# EAGLE design SparkFun RTK Facet - Display SD SIM (EAGLE 9.6.2)
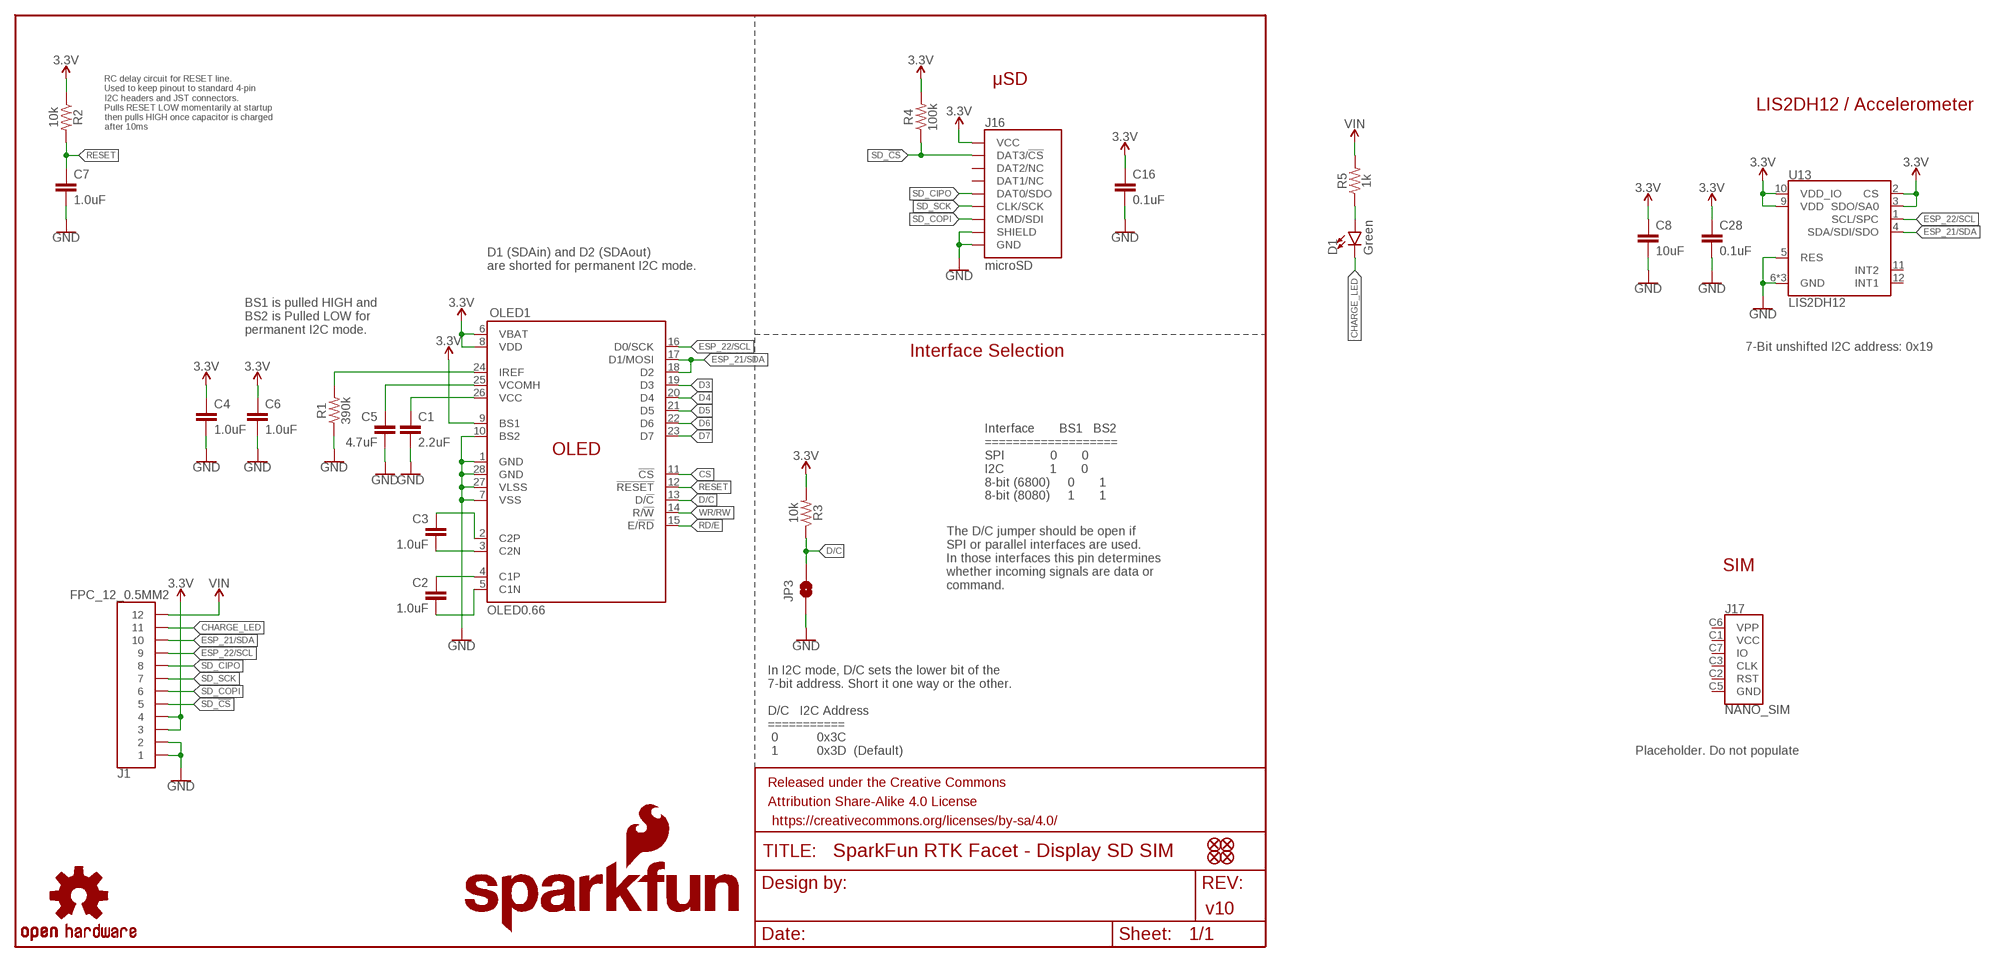
[diagram p0: schematic, sheet 1]

## Parts
C1  2.2uF  2.2UF-0805-25V-(+80/-20%)  [0805]
C2  1.0uF  1.0UF-0805-25V-10%  [0805]
C3  1.0uF  1.0UF-0805-25V-10%  [0805]
C4  1.0uF  1.0UF-0603-16V-10%  [0603]
C5  4.7uF  4.7UF-1206-16V-(+80/-20%)  [1206]
C6  1.0uF  1.0UF-0603-16V-10%  [0603]
C7  1.0uF  1.0UF-0603-16V-10%  [0603]
C8  10uF  10UF-0603-6.3V-20%  [0603]
C16  0.1uF  0.1UF-0603-25V-(+80/-20%)  [0603]
C28  0.1uF  0.1UF-0603-25V-(+80/-20%)  [0603]
D1  Green  LED-GREEN1206-BOTTOM  [LED-1206-BOTTOM]
FID1  FIDUCIAL1X2  [FIDUCIAL-1X2]
FID2  FIDUCIAL1X2  [FIDUCIAL-1X2]
FID3  FIDUCIAL1X2  [FIDUCIAL-1X2]
FID4  FIDUCIAL1X2  [FIDUCIAL-1X2]
FRAME1  FRAME-LETTER  [CREATIVE_COMMONS]
J1  FPC_12_0.5MM2  [FPC_12_FLIP_DOUBLESIDED_2]
J16  microSD  MICRO-SD-SDIOPUSH-PUSH  [MICRO-SD-SOCKET]
J17  NANO_SIM  NANO_SIMWURTH  [NANO_SIM_WURTH_693043020611]
JP3  JUMPER-SMT_2_NO_SILK  [SMT-JUMPER_2_NO_SILK]
LOGO3  OSHW-LOGOS  [OSHW-LOGO-S]
LOGO5  SFE_LOGO_NAME_FLAME.1_INCH  [SFE_LOGO_NAME_FLAME_.1]
OLED1  OLED0.66  [OLED-0.66-64X48]
R1  390k  390KOHM-0603-1/10W-1%  [0603]
R2  10k  10KOHM-0603-1/10W-1%  [0603]
R3  10k  10KOHM-0603-1/10W-1%  [0603]
R4  100k  100KOHM-0603-1/10W-1%  [0603]
R5  1k  1KOHM-0603-1/10W-1%  [0603]
U13  LIS2DH12  [LGA-12-LISDH12]

## Nets
3.3V [power]: C4.1 C6.1 C8.1 C16.1 C28.1 J1.3 J1.4 J16.VCC OLED1.6(VBAT) OLED1.8(VDD) OLED1.9(BS1) R2.1 R3.2 R4.2 U13.2(CS) U13.3(SDO/SA0) U13.9(VDD) U13.10(VDD_IO)
C1P: C2.1 OLED1.4(C1P)
C2N: C3.2 OLED1.3(C2N)
CHARGE_LED: D1.C J1.11
CS: OLED1.11(!CS!)
D3: OLED1.19(D3)
D4: OLED1.20(D4)
D5: OLED1.21(D5)
D6: OLED1.22(D6)
D7: OLED1.23(D7)
D/C: JP3.2 OLED1.13(D/!C!) R3.1
ESP_21/SDA: J1.10 OLED1.17(D1/MOSI) OLED1.18(D2) U13.4(SDA/SDI/SDO)
ESP_22/SCL: J1.9 OLED1.16(D0/SCK) U13.1(SCL/SPC)
GND: C1.2 C4.2 C5.2 C6.2 C7.2 C8.2 C16.2 C28.2 J1.1 J1.2 J16.CD1(SHIELD) J16.GND J16.GND1(GND) J16.GND3(GND) JP3.1 OLED1.1(GND) OLED1.7(VSS) OLED1.10(BS2) OLED1.27(VLSS) OLED1.28(GND) R1.1 U13.5(RES) U13.6(GND) U13.7(GND) U13.8(GND)
IREF: OLED1.24(IREF) R1.2
N$1: C3.1 OLED1.2(C2P)
N$2: C2.2 OLED1.5(C1N)
N$3: D1.A R5.1
RD/E: OLED1.15(E/!RD!)
RESET: C7.1 OLED1.12(!RESET!) R2.2
SD_!CS!: J1.5 J16.CS/DAT3(DAT3/!CS!) R4.1
SD_CIPO: J1.8 J16.DO/DAT0(DAT0/SDO)
SD_COPI: J1.6 J16.DI/CMD(CMD/SDI)
SD_SCK: J1.7 J16.SCLK(CLK/SCK)
VCC: C1.1 OLED1.26(VCC)
VCOMH: C5.1 OLED1.25(VCOMH)
VIN: J1.12 R5.2
WR/RW: OLED1.14(R/!W!)
Unconnected: J16.DAT1(DAT1/NC) J16.DAT2(DAT2/NC) J17.C1(VCC) J17.C2(RST) J17.C3(CLK) J17.C5(GND) J17.C6(VPP) J17.C7(IO) U13.11(INT2) U13.12(INT1)

## Notes on the sheet
- μSD
- LIS2DH12 / Accelerometer
- RC delay circuit for RESET line. 
  Used to keep pinout to standard 4-pin
  I2C headers and JST connectors. 
  Pulls RESET LOW momentarily at startup
  then pulls HIGH once capacitor is charged
  after 10ms
- D1 (SDAin) and D2 (SDAout)
  are shorted for permanent I2C mode.
- BS1 is pulled HIGH and 
  BS2 is Pulled LOW for 
  permanent I2C mode.
- 7-Bit unshifted I2C address: 0x19
- Interface Selection
- Interface       BS1   BS2
  ===================
  SPI             0       0
  I2C             1       0
  8-bit (6800)     0       1
  8-bit (8080)     1       1
- SIM
- The D/C jumper should be open if
  SPI or parallel interfaces are used.
  In those interfaces this pin determines
  whether incoming signals are data or
  command.
- In I2C mode, D/C sets the lower bit of the 
  7-bit address. Short it one way or the other.
  
  D/C   I2C Address
  ===========
   0           0x3C
   1           0x3D  (Default)
- Placeholder. Do not populate
- v10

## Library data of the parts
C1 = SparkFun-Capacitors:2.2UF: 2.2µF ceramic capacitors A capacitor is a passive two-terminal electrical component used to store electrical energy temporarily in an electric field.; PROD_ID: CAP-11624
C2 C3 = SparkFun-Capacitors:1.0UF: 1µF ceramic capacitors A capacitor is a passive two-terminal electrical component used to store electrical energy temporarily in an electric field.; PROD_ID: CAP-08064
C4 C6 C7 = SparkFun-Capacitors:1.0UF: 1µF ceramic capacitors A capacitor is a passive two-terminal electrical component used to store electrical energy temporarily in an electric field.; PROD_ID: CAP-00868
C5 = SparkFun-Capacitors:4.7UF: 4.7µF ceramic capacitors A capacitor is a passive two-terminal electrical component used to store electrical energy temporarily in an electric field.; PROD_ID: CAP-10300
C8 = SparkFun-Capacitors:10UF: 10.0µF ceramic capacitors A capacitor is a passive two-terminal electrical component used to store electrical energy temporarily in an electric field.; PROD_ID: CAP-11015
C16 C28 = SparkFun-Capacitors:0.1UF: 0.1µF ceramic capacitors A capacitor is a passive two-terminal electrical component used to store electrical energy temporarily in an electric field.; PROD_ID: CAP-00810
D1 = SparkFun-LED:LED-GREEN: Green SMD LED Used in manufacturing of various products at SparkFun Packages: 0603 - SMD 0603 package [Product Link] <http://www.futureelectronics.com/en/technologies/semiconductors/optoelectronics/leds/Pages/9894312-LTST-C190GKT.aspx?CrossPart=HSMG-C190&IM=0> LilyPad 1206 - SMD1206 LilyPad package [Product Link] <http://www.futureelectronics.com/en/Technologies/Product.aspx?ProductID=IN150NGHARVATEKCORPORATION2049943&IM=0> 1206 - SMD1206 package [Product Link] <http://www.futureelectronics.com/en/technologies/semiconductors/optoelectronics/leds/Pages/8315665-LTST-C150KGKT.aspx?IM=0> 1206 Bottom Mount -SMD 1206 Bottom Mount [Product Link] <http://www.digikey.com/product-detail/en/lite-on-inc/LTST-C230KGKT/160-1456-1-ND/386854> SparkFun Products: Pro Mini 328 -5V <https://www.sparkfun.com/products/821> RedBoard <https://www.sparkfun.com/products/12757> MP3 Trigger <https://www.sparkfun.com/products/13720> Makey Makey <https://www.sparkfun.com/products/11076>; PROD_ID: DIO-11076
FID1-FID4 = SparkFun-Aesthetics:FIDUCIAL: Fiducial Alignment Points Point-of-reference for pick-and-place machines and other optical instruments.
FRAME1 = SparkFun-Aesthetics:FRAME-LETTER: Schematic Frame - Letter Standard 8.5x11 US Letter frame
J1 = RTK Facet:FPC_12_0.5MM
J16 = SparkFun-Connectors:MICRO-SD-SDIO: microSD Socket for Transflash Push-push type µSD socket. tDoc lines correctly indicate media card edge positions when inserting (unlocked, locked, depressed). NOTE: CD1 and CD2 are connected internally, and the default detect state of the socket is detect pin to ground. SparkFun Products: WAV Trigger <https://www.sparkfun.com/products/13660> CAN-Bus Shield <https://www.sparkfun.com/products/13262> SparkFun Level Shifing microSD Breakout <https://www.sparkfun.com/products/13743>; PROD_ID: CONN-07820
J17 = ublox:NANO_SIM; PROD_ID: CONN-14097
JP3 = SparkFun-Jumpers:JUMPER-SMT_2_NO: Normally open jumper This jumper has two pads in close proximity to each other. Apply solder to close the connection. Round pads are easier to solder for beginners, but are a lot larger. SparkFun Product that uses the round pads: SparkFun EL Sequencer <https://www.sparkfun.com/products/12781>
LOGO3 = SparkFun-Aesthetics:OSHW-LOGO: Open-Source Hardware (OSHW) Logo This logo indicates the piece of hardware it is found on incorporates a OSHW license and/or adheres to the definition of open source hardware found here: http://freedomdefined.org/OSHW
LOGO5 = SparkFun-Aesthetics:SFE_LOGO_NAME_FLAME: SparkFun Font Logo w/ Flame This is the SparkFun full logo. The logo on the schematic will always be the same size; the package variant is the height of the flame part of the logo. Default layer for the logo on the board is tSilk.
OLED1 = SparkFun-Displays:OLED0.66: Micro OLED TODO: Add description SparkFun Products: Micro OLED Breakout <https://www.sparkfun.com/products/13003>; PROD_ID: LCD-12019
R1 = SparkFun-Resistors:390KOHM: 390kΩ resistor A resistor is a passive two-terminal electrical component that implements electrical resistance as a circuit element. Resistors act to reduce current flow, and, at the same time, act to lower voltage levels within circuits. - Wikipedia; PROD_ID: RES-12024
R2 R3 = SparkFun-Resistors:10KOHM: 10kΩ resistor A resistor is a passive two-terminal electrical component that implements electrical resistance as a circuit element. Resistors act to reduce current flow, and, at the same time, act to lower voltage levels within circuits. - Wikipedia; PROD_ID: RES-00824
R4 = SparkFun-Resistors:100KOHM: 100kΩ resistor A resistor is a passive two-terminal electrical component that implements electrical resistance as a circuit element. Resistors act to reduce current flow, and, at the same time, act to lower voltage levels within circuits. - Wikipedia; PROD_ID: RES-07828
R5 = SparkFun-Resistors:1KOHM: 1kΩ resistor A resistor is a passive two-terminal electrical component that implements electrical resistance as a circuit element. Resistors act to reduce current flow, and, at the same time, act to lower voltage levels within circuits. - Wikipedia; PROD_ID: RES-07856
U13 = SparkFun-Sensors:LIS2DH12; DIGIKEY: 497-14851-2-ND; PROD_ID: IC-14229

## Net classes
0 default: width 0 mm, drill 0 mm
1 power: width 0.178 mm

## Board
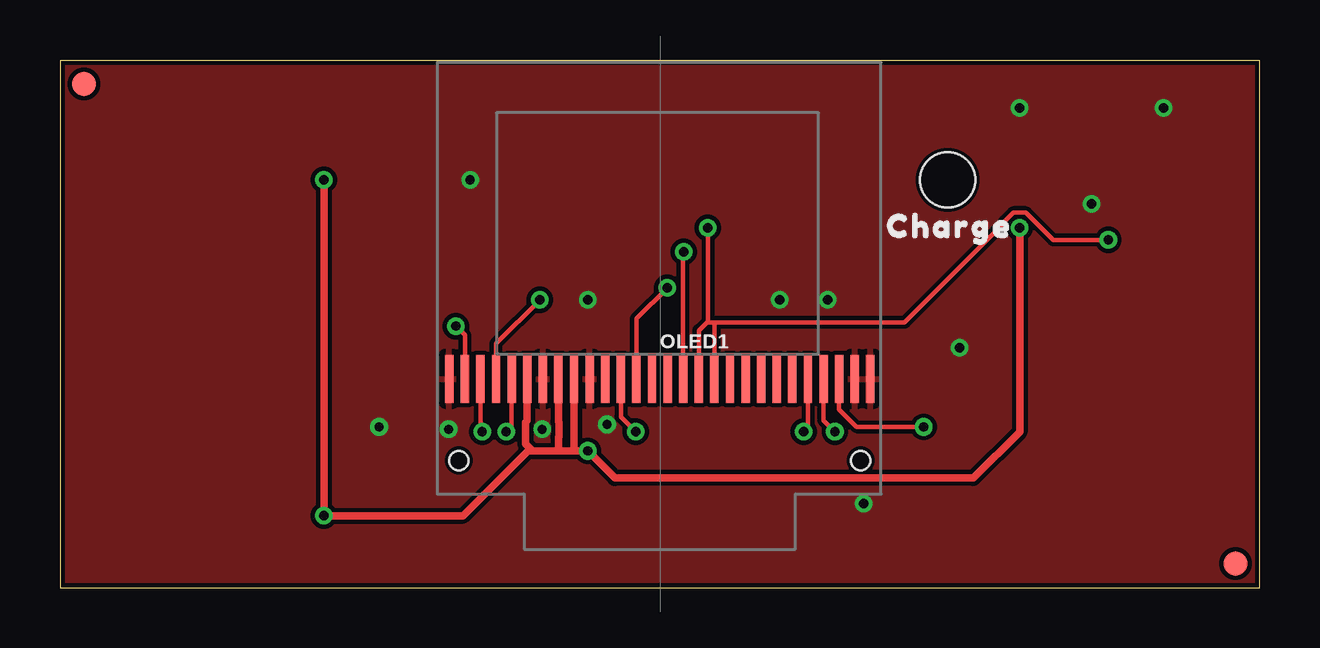
[diagram p1: board, top side]
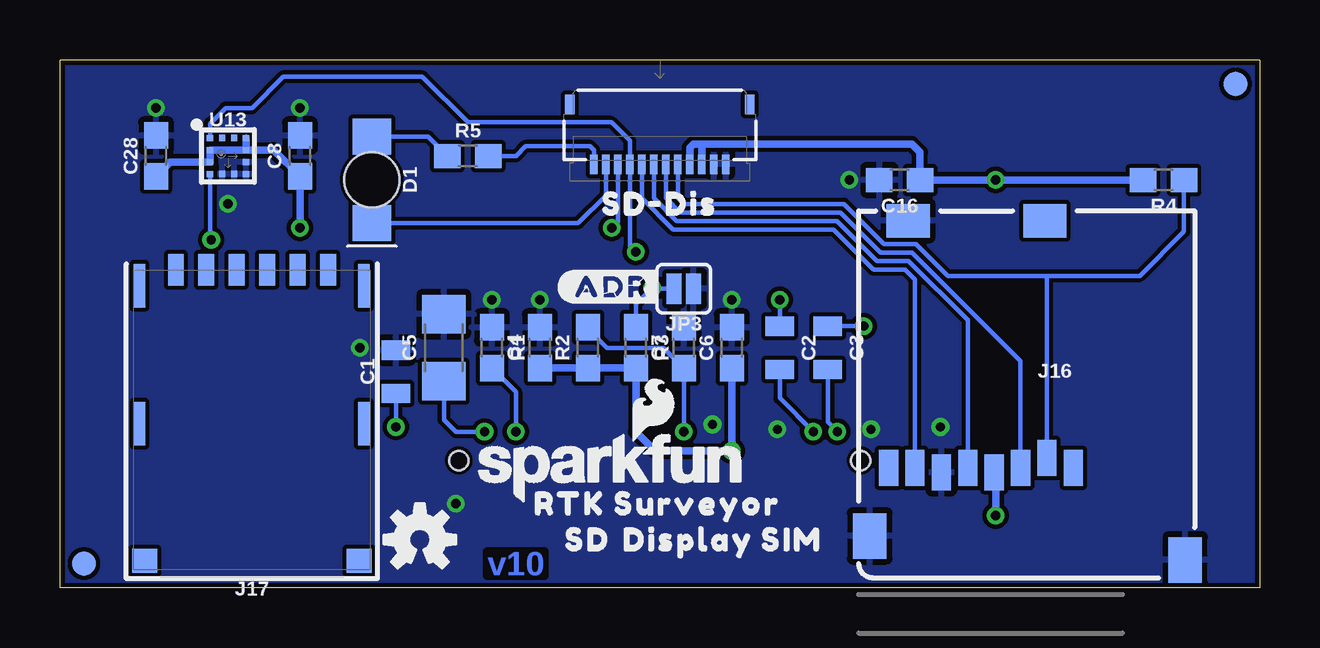
[diagram p2: board, bottom side, seen from below]

Size 50 x 22 mm. Coordinates in mm from the lower left corner, seen from the top.
Outline: 50,0 50,22 0,22 0,0 50,0
Copper layers (1*16): Top 0.035mm / dielectric 1.5mm / Bottom 0.035mm
Design rules "SparkFun-2-layer-TIGHT": minimum track width 7mil, minimum drill 15mil, track to track 7mil, track to pad 7mil, pad to pad 7mil, via to via 7mil, smd to smd 7mil, copper to edge 7mil, drill to drill 7mil, minimum pad ring 7mil, minimum via ring 7mil, stop-mask expansion 4mil, vias tented up to drill 25mil, thermal gap 10mil
tKeepout: area 0,0 to 2,22; area 48,0 to 50,22
bKeepout: area 0,0 to 2,22; area 48,0 to 50,22

### Footprints (pad centres in the part's own frame; a part is rotated, then mirrored left to right if it is on the bottom)
0805 = smd 0.8 x 1.2: 1 -0.9,0; 2 0.9,0
0603 = smd 1.1 x 1: 1 -0.85,0; 2 0.85,0
1206 = smd 1.6 x 1.8: 1 -1.4,0; 2 1.4,0
LED-1206-BOTTOM = smd 1.5 x 1.6: A -1.8,0; C 1.8,0 | hole 2.3: 0,0
FIDUCIAL-1X2 = smd 1 x 1: 1 0,0
FPC_12_FLIP_DOUBLESIDED_2 = smd 0.3 x 0.8: 1 -2.75,1.35; 2 -2.25,1.35; 3 -1.75,1.35; 4 -1.25,1.35; 5 -0.75,1.35; 6 -0.25,1.35; 7 0.25,1.35; 8 0.75,1.35; 9 1.25,1.35; 10 1.75,1.35; 11 2.25,1.35; 12 2.75,1.35 | smd 0.4 x 0.8: MP1 -3.75,-1.15; MP2 3.75,-1.15
MICRO-SD-SOCKET = smd 1.8 x 1.4: CD1 -2.05,0.4; CD2 -7.75,0.4 | smd 0.8 x 1.5: CS/DAT3 -7.84,10.3; DAT1 -1.24,10.7; DAT2 -8.94,10.7; DI/CMD -6.74,10.7; DO/DAT0 -2.34,10.7; GND -3.44,10.9; SCLK -4.54,10.7; VCC -5.64,10.9 | smd 1.4 x 1.9: GND1 -13.6,14.55; GND3 -0.45,13.55
NANO_SIM_WURTH_693043020611 = smd 0.65 x 1.3: C1 1.905,6.25; C2 -0.635,6.25; C3 -1.905,6.25; C5 3.175,6.25; C6 0.635,6.25; C7 -3.175,6.25 | smd 0.48 x 1.8: MNT1 -4.69,5.58; MNT2 4.66,5.58; MNT3 -4.69,-0.17; MNT4 4.66,-0.17 | smd 1.03 x 1: MNT5 -4.465,-5.89; MNT6 4.465,-5.89
SMT-JUMPER_2_NO_SILK = smd 0.635 x 1.27: 1 -0.406,0; 2 0.406,0
OLED-0.66-64X48 = smd 0.35 x 2: 1 -8.775,0; 2 -8.125,0; 3 -7.475,0; 4 -6.825,0; 5 -6.175,0; 6 -5.525,0; 7 -4.875,0; 8 -4.225,0; 9 -3.575,0; 10 -2.925,0; 11 -2.275,0; 12 -1.625,0; 13 -0.975,0; 14 -0.325,0; 15 0.325,0; 16 0.975,0; 17 1.625,0; 18 2.275,0; 19 2.925,0; 20 3.575,0; 21 4.225,0; 22 4.875,0; 23 5.525,0; 24 6.175,0; 25 6.825,0; 26 7.475,0; 27 8.125,0; 28 8.775,0 | hole 0.8: 8.375,-3.4; -8.375,-3.4
LGA-12-LISDH12 = smd 0.275 x 0.25: 1 -0.75,0.75; 2 -0.75,0.25; 3 -0.75,-0.25; 4 -0.75,-0.75; 7 0.75,-0.75; 8 0.75,-0.25; 9 0.75,0.25; 10 0.75,0.75 | smd 0.25 x 0.275: 5 -0.25,-0.75; 6 0.25,-0.75; 11 0.25,0.75; 12 -0.25,0.75

### Placement (x,y rotation side)
C1  36,9 90 bottom
C2  20,10 270 bottom
C3  18,10 270 bottom
C4  30,10 90 bottom
C5  34,10 90 bottom
C6  22,10 90 bottom
C7  24,10 90 bottom
C8  40,18 90 bottom
C16  15,17 180 bottom
C28  46,18 90 bottom
D1  37,17 270 bottom
FID1  49,1 0 top
FID2  1,21 0 top
FID3  1,21 0 bottom
FID4  49,1 0 bottom
FRAME1  -2.57,-29.5 0 top  (outside the outline)
J1  25,19 180 bottom
J16  16.7,15.7 180 bottom
J17  42,7 0 bottom
JP3  24,12.46 180 bottom
LOGO3  35,2 0 bottom
LOGO5  27,5 0 bottom
OLED1  25,8.7 0 top
R1  32,10 270 bottom
R2  28,10 90 bottom
R3  26,10 270 bottom
R4  4,17 180 bottom
R5  33,18 0 bottom
U13  43,18 0 bottom
U$1  [SD#DIS0]  25,16 0 bottom
U$3  [DISPLAY0]  23.8,2 0 bottom
U$4  [SD1]  28,2 0 bottom
U$5  [SIM2]  19.5,2 0 bottom
U$6  [RTK_SURVEYOR0]  25.1,3.5 0 bottom
U$7  [#ADR#0]  27,12.54 0 bottom
U$8  [CHARGE0]  37.08,15.06 0 top

### Tracks (layer width: path | path; a pad name or v marks a point on that pad's centre or on a via)
3.3V  (via drill 0.38)
  Top 0.305: v11,17 v11,3 16.8,3 19.5,5.7 19.7,5.7 | v40,15 40,6.5 38.07,4.57 23.13,4.57 v22,5.7 21.4,5.7 | 19.7,5.7 20.8,5.7 | 20.8,5.7 21.4,5.7 | OLED1.9 21.43,5.72 21.4,5.7 | 20.8,5.7 20.77,5.72 20.77,6.29 20.8,6.31 20.8,6.89 20.77,6.91 OLED1.8 | OLED1.6 19.48,6.96 19.4,6.89 19.4,6 19.7,5.7
  Bottom 0.305: C4.1 R2.1 R3.2 26,6.5 25.2,5.7 v22,5.7 C6.1 | U13.9 U13.10 | U13.9 41.1,18.25 C8.1 v40,15 | U13.9 U13.2 U13.3 45.4,17.75 C28.1 | J16.VCC 11,4.74 v11,3 | R4.2 v11,17 C16.1 14.15,18.15 14.5,18.5 23.2,18.5 | J1.4 23.75,18.35 23.6,18.5 23.2,18.5 | J1.3 23.25,18.45 23.2,18.5
C1P  (via drill 0.38)
  Top 0.178: OLED1.4 18.18,10.18 v20,12
  Bottom 0.178: v20,12 C2.1
C2N  (via drill 0.38)
  Top 0.178: v17.6,6.5 17.52,6.58 OLED1.3
  Bottom 0.178: C3.2 18,6.9 v17.6,6.5
CHARGE_LED
  Bottom 0.178: D1.C 28.4,15.2 27.25,16.35 J1.11
D/C  (via drill 0.38)
  Top 0.178: OLED1.13 24.02,11.21 v25.32,12.5
  Bottom 0.178: JP3.2 25.27,12.46 v25.32,12.5 26,11.81 R3.1
ESP_21/SDA  (via drill 0.38)
  Top 0.178: v43.7,14.5 41.4,14.5 40.26,15.63 39.74,15.63 39.37,15.26 39.37,15.22 35.2,11.05 27.3,11.05 | 27.3,11.05 27.05,11.05 27,11.1 | v27,15 27,11.1 | OLED1.17 26.62,10.72 27,11.1 | OLED1.18 27.27,11.03 27.3,11.05
  Bottom 0.178: J1.10 26.75,15.25 v27,15 | U13.4 43.75,14.55 v43.7,14.5
ESP_22/SCL  (via drill 0.38)
  Top 0.178: v26,14 25.98,13.97 OLED1.16
  Bottom 0.178: v26,14 26.25,14.25 J1.9 26.25,18.63 27.02,19.4 33,19.4 34.9,21.3 40.7,21.3 42,20 43.1,20 43.75,19.35 U13.1
GND  (via drill 0.38)
  other vias: 17.1,17 22,12 30,12 32,12 43,16 40,20 46,20 13.3,6.7 16.2,6.6 33.5,3.5 20.1,6.6 22.8,6.8 37.5,10
  pour Bottom (isolate 0.152): 50,0 50,22 0,22 0,0
  pour Top (isolate 0.152): 50,0 50,22 0,22 0,0
IREF  (via drill 0.38)
  Top 0.178: OLED1.24 31.18,6.67 v31,6.5
  Bottom 0.178: R1.2 31,8.15 v31,6.5
N$1  (via drill 0.38)
  Top 0.178: OLED1.2 16.88,10.53 v16.5,10.9
  Bottom 0.178: v16.5,10.9 C3.1
N$2  (via drill 0.38)
  Top 0.178: v18.6,6.5 18.82,6.72 OLED1.5
  Bottom 0.178: C2.2 20,7.9 v18.6,6.5
N$3
  Bottom 0.178: R5.1 34.65,18.8 D1.A
RESET  (via drill 0.38)
  Top 0.178: OLED1.12 23.38,7.12 v24,6.5
  Bottom 0.178: R2.2 28,10.8 27.2,10 24.85,10 C7.1 v24,6.5
SD_!CS!
  Bottom 0.178: J1.5 24.25,16.25 24,16 17.33,16 15.66,14.33 14.33,14.33 13,13 8.8,13 | R4.1 3.15,14.85 5,13 8.8,13 | 8.8,13 8.86,12.94 J16.CS/DAT3
SD_CIPO
  Bottom 0.178: J1.8 25.75,16.24 24.44,14.93 17.77,14.93 16.1,13.27 14.78,13.27 14.36,12.85 J16.DO/DAT0
SD_COPI
  Bottom 0.178: J16.DI/CMD 9.96,9.46 14.48,13.98 15.81,13.98 17.47,15.64 24.15,15.64 24.75,16.25 J1.6
SD_SCK
  Bottom 0.178: J1.7 25.25,16.24 24.3,15.29 17.62,15.29 15.96,13.62 14.63,13.62 12.16,11.15 J16.SCLK
VCC  (via drill 0.38)
  Top 0.178: OLED1.26 32.48,7.42 33.2,6.7 v36,6.7
  Bottom 0.178: v36,6.7 C1.1
VCOMH  (via drill 0.38)
  Top 0.178: OLED1.25 31.82,6.97 v32.3,6.5
  Bottom 0.178: v32.3,6.5 33.5,6.5 34,7 C5.1
VIN
  Bottom 0.178: J1.12 27.75,18.25 27.9,18.4 30.6,18.4 31,18 R5.2

### Text on the board
Bottom: v10